# Altium schematic sheet Energetski deo.SchDoc
size A4
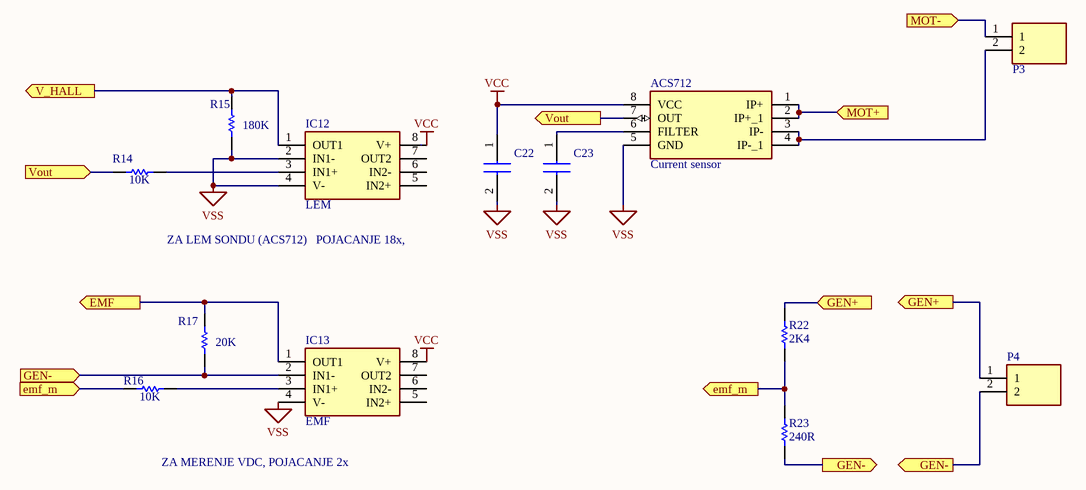
[diagram p0: Energetski deo.SchDoc]

## Parts
ACS712  Current sensor  [SOIC127P600X175-8N]
C22  C0805C104K9RACTU  [CAP10, 0.1uF, 6.4V]  (value not drawn)
C23  C1206Y102K9RAC7800  [CAP9, 1000pF, 6.3V]  (value not drawn)
IC12  LEM  [SOIC127P600X175-8N]
IC13  EMF  [SOIC127P600X175-8N]
P3  Connector 2  [HEADER 2 PIN]  (value not drawn)
P4  Connector 2  [HEADER 2 PIN]  (value not drawn)
R14  CFR-25JR-52-10K  [RES4, 10K, 0.25W]  (value not drawn)
R15  CFR-25JB-52-180K  [RES9, 180K, 0.25W]  (value not drawn)
R16  CFR-25JR-52-10K  [RES4, 10K, 0.25W]  (value not drawn)
R17  CFR-50JB-52-20K  [RES8, 20K, 0.25W]  (value not drawn)
R22  value 2K4  [RES2, 2K4, 0.25W]  (hidden comment: 270QBK-ND)
R23  value 240R  [RES1, 240R, 0.25W]  (hidden comment: 270QBK-ND)

## Ports
EMF (out), emf_m (in), emf_m (out), GEN+ (in), GEN+ (out), GEN- (in), GEN- (out), MOT+ (in), MOT- (in), V_HALL (out), Vout (in), Vout (out)

## Nets
VCC: ACS712.8(VCC) C22.1 IC12.8(V+) IC13.8(V+)
VSS: ACS712.5(GND) C22.2 C23.2 IC12.2(IN1-) IC12.4(V-) IC13.4(V-) R15.1
EMF: IC13.1(OUT1) R17.2 ; port EMF
emf_m: R16.2 R22.1 R23.2 ; port emf_m
GEN+: P4.1 R22.2 ; port GEN+
GEN-: IC13.2(IN1-) P4.2 R17.1 R23.1 ; port GEN-
MOT+: ACS712.1(IP+) ACS712.2(IP+_1) ; port MOT+
MOT-: P3.1 ; port MOT-
V_HALL: IC12.1(OUT1) R15.2 ; port V_HALL
Vout: ACS712.7(OUT) R14.2 ; port Vout
NetACS712_3: ACS712.3(IP-) ACS712.4(IP-_1) P3.2
NetACS712_6: ACS712.6(FILTER) C23.1
NetIC12_3: IC12.3(IN1+) R14.1
NetIC13_3: IC13.3(IN1+) R16.1

Not connected (* = marked no-connect by the designer): IC12 5(IN2+) 6(IN2-) 7(OUT2); IC13 5(IN2+) 6(IN2-) 7(OUT2)

## Notes on the sheet
- ZA LEM SONDU (ACS712)   POJACANJE 18x,
- ZA MERENJE VDC, POJACANJE 2x
- (in symbol Res4) 10K
- (in symbol Res8) 20K
- (in symbol Res9) 180K

## Library data of the parts
ACS712 = Current sensor: ACS712ELCTR-05B-T; Manufacturer_Name: Allegro Microsystems; Allied_Number: R1076681; Datasheet Link: http://docs-emea.rs-online.com/webdocs/0d88/0900766b80d885f5.pdf; Height: 1.75mm; Manufacturer_Part_Number: ACS712ELCTR-05B-T; RS Part Number: 6807131P; RS Price/Stock: http://uk.rs-online.com/web/p/products/6807131P; Allied Price/Stock: http://www.alliedelec.com/allegro-microsystems-acs712elctr-05b-t/R1076681/
C22 = Cap10: CER 0.1uF, 6.3V; Manufacturer_Name: Kemet; Datasheet Link: https://content.kemet.com/datasheets/KEM_C1002_X7R_SMD.pdf; Height: 0.88mm; Manufacturer_Part_Number: C0805C104K9RACTU; Arrow Part Number: C0805C104K9RACTU; Arrow Price/Stock: https://www.arrow.com/en/products/c0805c104k9ractu/kemet-corporation; Mouser Part Number: 80-C0805C104K9R; Mouser Price/Stock: https://www.mouser.co.uk/ProductDetail/KEMET/C0805C104K9RACTU?qs=jbCUrP3sAgRYLjBU7s5h8Q%3D%3D
C23 = Cap9: CER 1000pF, 6.3V; Manufacturer_Name: Kemet; Manufacturer_Part_Number: C1206Y102K9RACTU; Detailed description: Multilayer Ceramic Capacitors MLCC - SMD/SMT 6.3V 1000pF X7R 1206 10%; Datasheet Link: https://content.kemet.com/datasheets/KEM_C1015_X7R_FF-CAP_SMD.pdf; Mouser Part Number: 80-C1206Y102K9R
IC12 IC13 = IC5: LM358BAIDR, OP AMP; Manufacturer_Name: Texas Instruments; Datasheet Link: https://www.ti.com/lit/gpn/LM358BA; Height: 1.75mm; Manufacturer_Part_Number: LM358BAIDR; Arrow Part Number: LM358BAIDR; Arrow Price/Stock: https://www.arrow.com/en/products/lm358baidr/texas-instruments; Mouser Part Number: 595-LM358BAIDR; Mouser Price/Stock: https://www.mouser.co.uk/ProductDetail/Texas-Instruments/LM358BAIDR?qs=Cb2nCFKsA8q09dK1DPRIKg%3D%3D
P3 P4 = Connector 2: Connector, 2 pin; Manufacturer: TE Connectivity AMP Connectors; Manufacturer Part Number: 282836-2; Detailed Description: 2 Position Wire to Board Terminal Block Horizontal with Board 0.197" (5.00mm) Through Hole; Digi-Key Part Number: A98076-ND; Datasheet link: https://www.te.com/commerce/DocumentDelivery/DDEController?Action=srchrtrv&DocNm=1308389_EUROSTYLE_TERMINAL_BLOCKS&DocType=CS&DocLang=English
R14 R16 = Res4: 10K, 0,25W; Manufacturer_Name: YAGEO (PHYCOMP); Datasheet Link: https://componentsearchengine.com/Datasheets/1/CFR-25JR-52-10K.pdf; Manufacturer_Part_Number: CFR-25JR-52-10K; Arrow Part Number: CFR-25JR-52-10K; Arrow Price/Stock: https://www.arrow.com/en/products/cfr-25jr-52-10k/yageo; Mouser Part Number: 603-CFR-25JR-5210K; Mouser Price/Stock: https://www.mouser.com/Search/Refine.aspx?Keyword=603-CFR-25JR-5210K
R15 = Res9: 180K, 025W; Manufacturer_Name: Yageo; Detailed Description: 180 kOhms ±5% 0.25W, 1/4W Through Hole Resistor Axial  Carbon Film; Datasheet Link: https://www.yageo.com/upload/media/product/products/datasheet/lr/Yageo_LR_CFR_1.pdf; Manufacturer_Part_Number: CFR-25JB-52-180K; Digi-Key Part Number: 180KQBK-ND
R17 = Res8: 20KOhm, 0.5W; Manufacturer_Name: YAGEO (PHYCOMP); Datasheet Link: http://www.yageo.com/documents/recent/Yageo%20LR_CFR_2013.pdf; Manufacturer_Part_Number: CFR-50JB-52-20K; Arrow Part Number: CFR-50JB-52-20K; Arrow Price/Stock: https://www.arrow.com/en/products/cfr-50jb-52-20k/yageo; Mouser Part Number: 603-CFR-50JB-52-20K; Mouser Price/Stock: https://www.mouser.co.uk/ProductDetail/Yageo/CFR-50JB-52-20K?qs=oypCK0zG326PKPIoPcSOTg%3D%3D
R22 = Res2: 2K4, 0.25W
R23 = Res1: 240 Ohm, 0.25W; Manufacturer: Yageo; Manufacturer Part Number: CFR-25JB-52-270R; Detailed Description: 240 Ohms ±5% 0.25W, 1/4W Through Hole Resistor Axial  Carbon Film; Digi-Key Part Number: 270QBK-ND; Datasheet link: https://www.yageo.com/upload/media/product/products/datasheet/lr/Yageo_LR_CFR_1.pdf